# Altium schematic sheet Power Supply.SchDoc
size A4; Author: KAJETAN ŚPIONEK; SheetNumber: 1
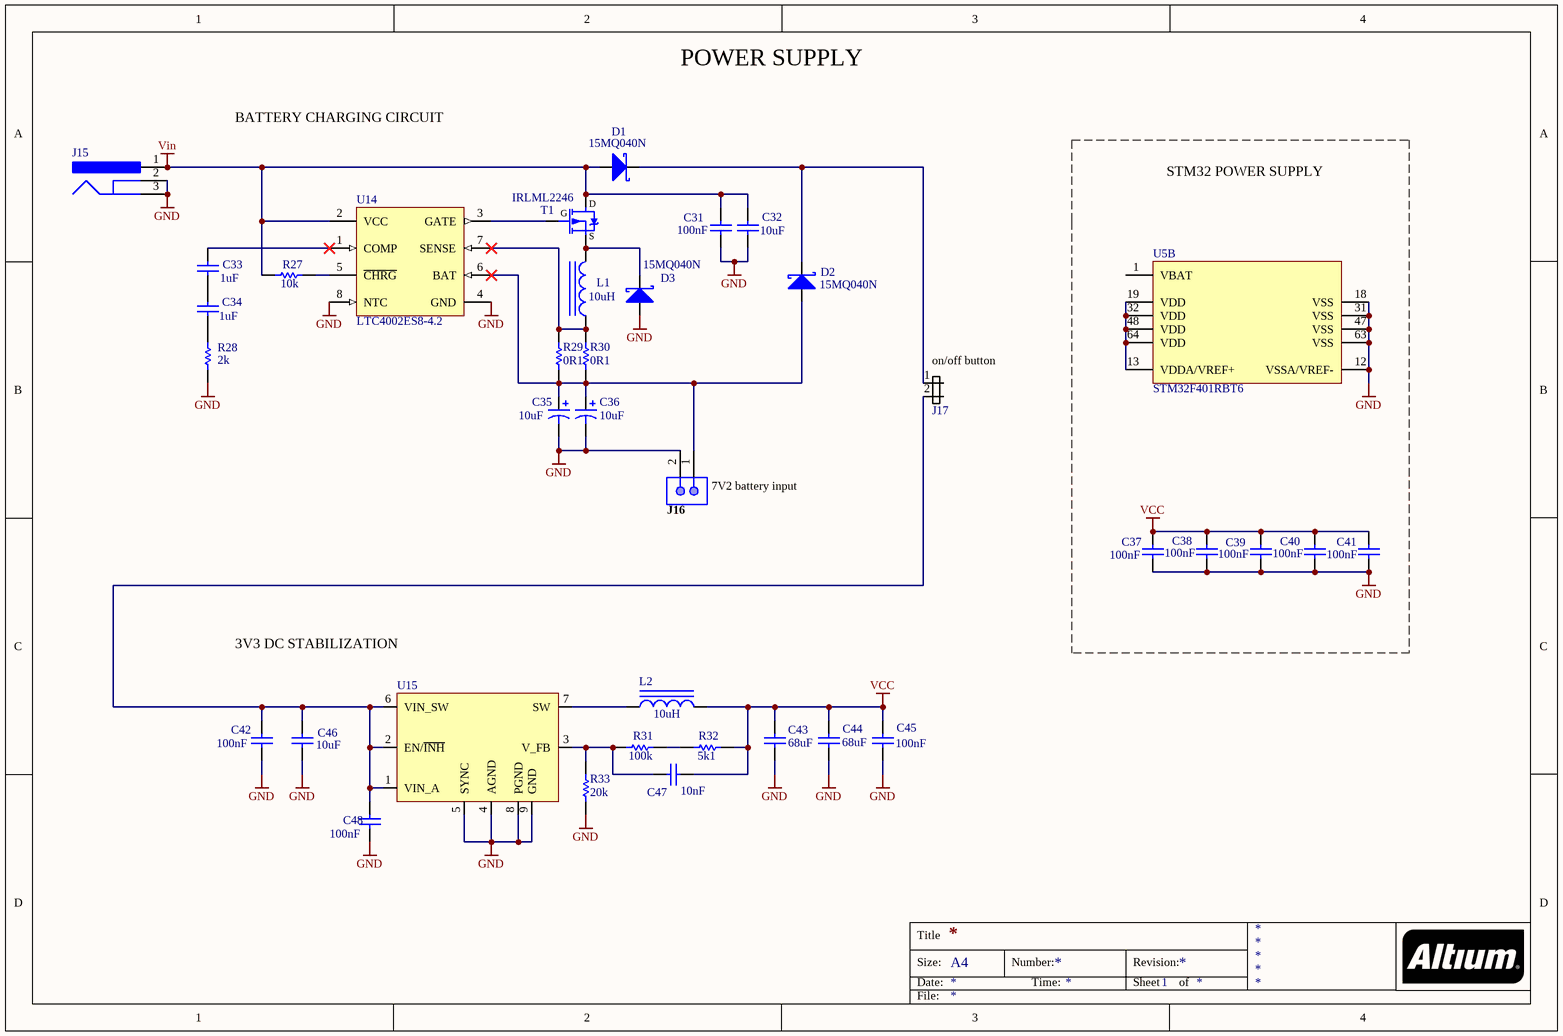
[diagram p0: Power Supply.SchDoc]

## Parts
C31  value 100nF  [CAPC0603(1608)100_N]  (hidden comment: CAP 100nF 25V 0603(1608))
C32  value 10uF  [CAPC0603(1608)100_M]  (hidden comment: CAP 10uF 6.3V 0603(1608))
C33  value 1uF  [CAPC0603(1608)100_N]  (hidden comment: CAP 1uF 16V 0603(1608))
C34  value 1uF  [CAPC0603(1608)100_N]  (hidden comment: CAP 1uF 16V 0603(1608))
C35  Capacitance: 10uF  [AVX-CAPC3528_V]  (hidden comment: TAJB106K020R)
C36  Capacitance: 10uF  [AVX-CAPC3528_V]  (hidden comment: TAJB106K020R)
C37  value 100nF  [CAPC0603(1608)100_N]  (hidden comment: CAP 100nF 25V 0603(1608))
C38  value 100nF  [CAPC0603(1608)100_N]  (hidden comment: CAP 100nF 25V 0603(1608))
C39  value 100nF  [CAPC0603(1608)100_N]  (hidden comment: CAP 100nF 25V 0603(1608))
C40  value 100nF  [CAPC0603(1608)100_N]  (hidden comment: CAP 100nF 25V 0603(1608))
C41  value 100nF  [CAPC0603(1608)100_N]  (hidden comment: CAP 100nF 25V 0603(1608))
C42  value 100nF  [CAPC0603(1608)100_N]  (hidden comment: CAP 100nF 25V 0603(1608))
C43  value 68uF  [CAPC1210(3225)220_M]  (hidden comment: CAP 68uF 6.3V 1210(3225))
C44  value 68uF  [CAPC1210(3225)220_M]  (hidden comment: CAP 68uF 6.3V 1210(3225))
C45  value 100nF  [CAPC0603(1608)100_N]  (hidden comment: CAP 100nF 25V 0603(1608))
C46  value 10uF  [CAPC0603(1608)100_M]  (hidden comment: CAP 10uF 6.3V 0603(1608))
C47  value 10nF  [CAPC0603(1608)100_L]  (hidden comment: CAP 10nF 16V 0603(1608))
C48  value 100nF  [CAPC0603(1608)100_N]  (hidden comment: CAP 100nF 25V 0603(1608))
D1  15MQ040N  [D_SMD_SMA]
D2  15MQ040N  [D_SMD_SMA]
D3  15MQ040N  [D_SMD_SMA]
J15  KLDX-0202-A  [KYCN-KLDX-0202-A_V]  (value not drawn)
J16  PH2541-2-SPGRH-6-3  [PH2541-2-SPGRH-6-3_V]  (value not drawn)
J17  (no value)  [J_THT_HDR_1x2_R2.54-V]
L1  value 10uH  [PKG_DER0705]  (hidden comment: 10uH DER0705-10)
L2  10uH  [PKG_DLCSS124P-100M]
R27  value 10k  [RESC0603(1608)_N]  (hidden comment: 10K 1% 0603(1608))
R28  value 2k  [RESC0603(1608)_N]  (hidden comment: 2K 1% 0603(1608))
R29  value 0R1  [RESC0603(1608)_N]  (hidden comment: 10K 1% 0603(1608))
R30  value 0R1  [RESC0603(1608)_N]  (hidden comment: 10K 1% 0603(1608))
R31  value 100k  [RESC0603(1608)_N]  (hidden comment: 100K 5% 0603(1608))
R32  value 5k1  [RESC0603(1608)_M]  (hidden comment: 5K1 1% 0603(1608))
R33  value 20k  [RESC0603(1608)_L]  (hidden comment: 20K 1% 0603(1608))
T1  IRLML2246  [SOT-23]
U5  STM32F401RBT6  [STM-LQFP64_N]  (part B of 2)
U14  LTC4002ES8-4.2  [LT-S8-8_L]
U15  (no value)  [SO8-N_THERMAL]

## Blocks framed on the sheet
STM32 POWER SUPPLY: C37-C41 U5

## Nets
GND: C31.1 C32.1 C35.2 C36.2 C37.1 C38.1 C39.1 C40.1 C41.1 C42.1 C43.1 C44.1 C45.1 C46.1 C48.1 D3.1(A) J15.2 J15.3 J16.2 R28.1 R33.1 U5.12(VSSA/VREF-) U5.18(VSS) U5.31(VSS) U5.47(VSS) U5.63(VSS) U14.4(GND) U14.8(NTC) U15.4(AGND) U15.5(SYNC) U15.8(PGND) U15.9(GND)
VCC: C37.2 C38.2 C39.2 C40.2 C41.2 C43.2 C44.2 C45.2 C47.2 L2.2 R32.2
Vin: C31.2 C32.2 D1.1(A) J15.1 R27.2 T1.3(D) U14.2(VCC)
NetC33_1: C33.1 C34.2
NetC33_2: C33.2 U14.1(COMP)
NetC34_1: C34.1 R28.2
NetC35_1: C35.1 C36.1 D2.1(A) J16.1 R29.2 R30.2 U14.6(BAT)
NetC42_2: C42.2 C46.2 C48.2 J17.2 U15.1(VIN_A) U15.2(EN/~{INH}) U15.6(VIN_SW)
NetC47_1: C47.1 R31.1 R33.2 U15.3(V_FB)
NetD1_2: D1.2(K) D2.2(K) J17.1
NetD3_2: D3.2(K) L1.1 T1.2(S)
NetL1_2: L1.2 R29.1 R30.1 U14.7(SENSE)
NetL2_1: L2.1 U15.7(SW)
NetR27_1: R27.1 U14.5(~{CHRG})
NetR31_2: R31.2 R32.1
NetT1_1: T1.1(G) U14.3(GATE)
NetU5_13: U5.13(VDDA/VREF+) U5.19(VDD) U5.32(VDD) U5.48(VDD) U5.64(VDD)

Not connected (* = marked no-connect by the designer): U5 1(VBAT)

## Notes on the sheet
- POWER SUPPLY
- BATTERY CHARGING CIRCUIT
- (near J17) on/off button
- (near J16) 7V2 battery input
- 3V3 DC STABILIZATION
- Title
- Size:
- Date:
- A4
- Number:
- Time:
- Revision:
- Sheet
- of
- File:

## Library data of the parts
C31 C37-C42 C45 C48 = CMP-1035-02589-1: CAP 100nF 25V ±20% 0603 (1608 Metric) Thickness 1mm SMD; Case-EIA: 0603; Tolerance: Â±20%; Case-Metric: 1608; Max Thickness: 1 mm; Technology: SMT; Rated Voltage: 25 V
C32 C46 = CMP-1035-02796-1: CAP 10uF 6.3V ±10% 0603 (1608 Metric) Thickness 1mm SMD; Case-EIA: 0603; Tolerance: Â±10%; Case-Metric: 1608; Technology: SMT; Rated Voltage: 6.3 V; Max Thickness: 1 mm
C33 C34 = CMP-1035-02736-1: CAP 1uF 16V ±5% 0603 (1608 Metric) Thickness 1mm SMD; Case-Metric: 1608; Case-EIA: 0603; Tolerance: Â±5%; Technology: SMT; Max Thickness: 1 mm; Rated Voltage: 16 V
C35 C36 = CMP-0279-00001-1: Capacitor, Tantalum, 10uF 10% 20V MCCT-B (3528); Manufacturer: AVX; Polarity: Polarized; PartNumber: TAJB106K020R; PackageDescription: 2-Pin SMT Capacitor, 3.5 x 2.8 mm Body; ComponentLink1URL: http://www.avx.com/; PackageReference: CAPC3528; ComponentLink2Description: Datasheet; Technology: Tantalum; ComponentLink2URL: http://www.avx.com/docs/Catalogs/taj.pdf; Tolerance: 10%; ComponentLink1Description: Manufacturer URL; Rated Voltage: 20V; DatasheetVersion: Jun-13; Mounting Technology: Surface Mount
C43 C44 = CMP-1038-02298-1: CAP 68uF 6.3V ±20% 1210 (3225 Metric) Thickness 2.2mm SMD; Case-Metric: 3225; Tolerance: Â±20%; Case-EIA: 1210; Technology: SMT; Max Thickness: 2.2 mm; Rated Voltage: 6.3 V
C47 = CMP-1035-02312-1: CAP 10nF 16V ±20% 0603 (1608 Metric) Thickness 1mm SMD; Case-EIA: 0603; Tolerance: Â±20%; Case-Metric: 1608; Max Thickness: 1 mm; Technology: SMT; Rated Voltage: 16 V
D1-D3 = D_15MQ040N: Dioda Schottky SMD 15MQ040N, 3A, 40V; Value: 15MQ040N
J15 = CMP-1673-00001-5: DC Power Jack, 24 V, 3.5 A, -25 to 85 degC, 3-Pin THD, RoHS; Manufacturer: Kycon; Voltage Rating: 24 V; Current Rating: 3.5 A; Height: 10.8 mm; Length: 9.2 mm; Pins: 2; Housing Material: PBT; Connector Type: Power; ComponentLink2URL: http://www.kycon.com/Pub_Eng_Draw/KLDX-0202-X.PDF; PackageDescription: 3-Pin Through Hole Device, Body 14.5 x 9 mm; Max Operating Temperature: 85 degC; Min Operating Temperature: -25 degC; PackageReference: KLDX-0202-A; Contact Gender: Female; Package Quantity: 500; Mount: Through Hole; Colour: Black; Contact Plating: Tin; DatasheetVersion: Rev. D3, 06/2013; ComponentLink2Description: Datasheet; RoHSCompliant: true; Mounting Technology: Through Hole; ComponentLink1Description: Manufacturer URL; Contact Material: Brass; ComponentLink1URL: http://www.kycon.com/
J16 = CMP-0261-00001-1: Male Header, Pitch 2.54mm, 2x1 Position, Mated Height 6mm, Tail Length 3mm; PackageDescription: 2-Pin Male Header IDC, 2.54 x 5.08 mm Body, 2.54 mm Pitch; PartNumber: PH2541-2-SPGRH-6-3; ComponentLink1URL: http://www.suzhoupinchao.com/; Mounting Technology: Through Hole; ComponentLink1Description: Manufacturer URL; PackageReference: PH2541-2-SPGRH-6-3
J17 = J_HDR_1x2_JUMPER: Złącze gold pin 1x2 na jumper
L1 = L_10uH_DER0705-10: Dławik mocy SMD DER0705-10, 10uH, 20%, 1.63A
L2 = L_DLCSS124P-100M: Dławik mocy SMD CSS124P100M, 10uH, 20%, 4.5A; Value: 10uH
R27 = CMP-1012-00623-1: 10K 0.1W 1% 0603 (1608 Metric)  SMD; Case-EIA: 0603; Case-Metric: 1608; Power: 0.1 W; Tolerance: 1 %; Technology: SMT
R28 = CMP-1012-00542-1: 2K 0.1W 1% 0603 (1608 Metric)  SMD; Case-EIA: 0603; Case-Metric: 1608; Power: 0.1 W; Technology: SMT; Tolerance: 1 %
R29 R30 = CMP-1012-00623-1: 0R1 0.1W 1% 0603 (1608 Metric)  SMD; Case-EIA: 0603; Case-Metric: 1608; Power: 0.1 W; Tolerance: 1 %; Technology: SMT
R31 = CMP-1012-00122-1: 100K 0.1W 5% 0603 (1608 Metric)  SMD; Case-EIA: 0603; Case-Metric: 1608; Tolerance: 5 %; Power: 0.1 W; Technology: SMT
R32 = CMP-1012-00590-1: 5K1 0.1W 1% 0603 (1608 Metric)  SMD; Case-Metric: 1608; Case-EIA: 0603; Power: 0.1 W; Technology: SMT; Tolerance: 1 %
R33 = CMP-1012-00655-1: 20K 0.1W 1% 0603 (1608 Metric)  SMD; Case-Metric: 1608; Case-EIA: 0603; Technology: SMT; Tolerance: 1 %; Power: 0.1 W
T1 = T_IRLML2246TRPbF: Tranzystor unipolarny P-MOSFET, HEXFET, -2.6A, -20V; Value: IRLML2246
U5 = CMP-0243-00094-2: ARM Cortex-M4 32-bit MCU+FPU, 105 DMIPS, 128 kB Flash, 64 kB Internal RAM, 48 I/Os, 64-pin LQFP, -40 to 85 degC, Tray; Manufacturer: STMicroelectronics; Internal RAM Size (kB): 64; FLASH Size (Prog) (kB): 128; Supply Voltage(Vcc) max (V): 3.6; I/Os (High Current): 48; Supply Voltage(Vcc) min (V): 1.8; Operating Frequency(F) (Processor speed) (MHz): 84; Core: ARM Cortex-M4; PackageDescription: 64-Pin Low Profile Quad Flat Package, 10 x 10 mm Body, 0.5 mm Pitch; Mounting Technology: Surface Mount; PackageVersion: Rev. 4, 06/2013; ComponentLink1URL: http://www.st.com/web/en/home.html; ComponentLink3Description: Package Specification; ComponentLink2Description: Datasheet; ComponentLink3URL: http://www.st.com/st-web-ui/static/active/en/resource/technical/document/datasheet/DM00037051.pdf; ComponentLink2URL: http://www.st.com/st-web-ui/static/active/en/resource/technical/document/data_brief/DM00071938.pdf; DatasheetVersion: Rev. 1; Packing: Tray; PackageReference: LQFP64; PartNumber: STM32F401RBT6; ComponentLink1Description: Manufacturer URL; PartId: 1
U14 = CMP-0471-00510-1: Standalone Li-Ion Switch Mode Battery Charger, 4.7 to 22 V Vin, 8-pin SOIC (S8-8), -40 to 85 degC; Manufacturer: Linear Technology; Battery Chemistry: Li-Ion, Li-Polymer; Vin Min(V): 4.7; Type of Charger: Switching; Number of Cells: 1; Vin Max(V): 22; Charge Termination: On-board timer; Float Voltage: 4.2 V; ComponentLink1URL: http://www.linear.com/; PartNumber: LTC4002ES8-4.2; PackageReference: S8-8; ComponentLink2URL: http://cds.linear.com/docs/en/datasheet/4002f.pdf; ComponentLink3Description: Package Specification; ComponentLink3URL: http://cds.linear.com/docs/en/packaging/05081610_G_SO8.pdf; Mounting Technology: Surface Mount; RoHS: FALSE; ComponentLink1Description: Manufacturer URL; PackageVersion: Rev. G, 03/2012; ComponentLink2Description: Datasheet; PackageDescription: 8-Pin Plastic Small Outline (Narrow .150 Inch), Body 4.9 x 3.9 mm, Pitch 1.27 mm
U15 = U_ST1S10PHR: Przetwornica step-down synchroniczna, 3 A, 900 kHz